# EAGLE design M8357pld (EAGLE 6.6.0)
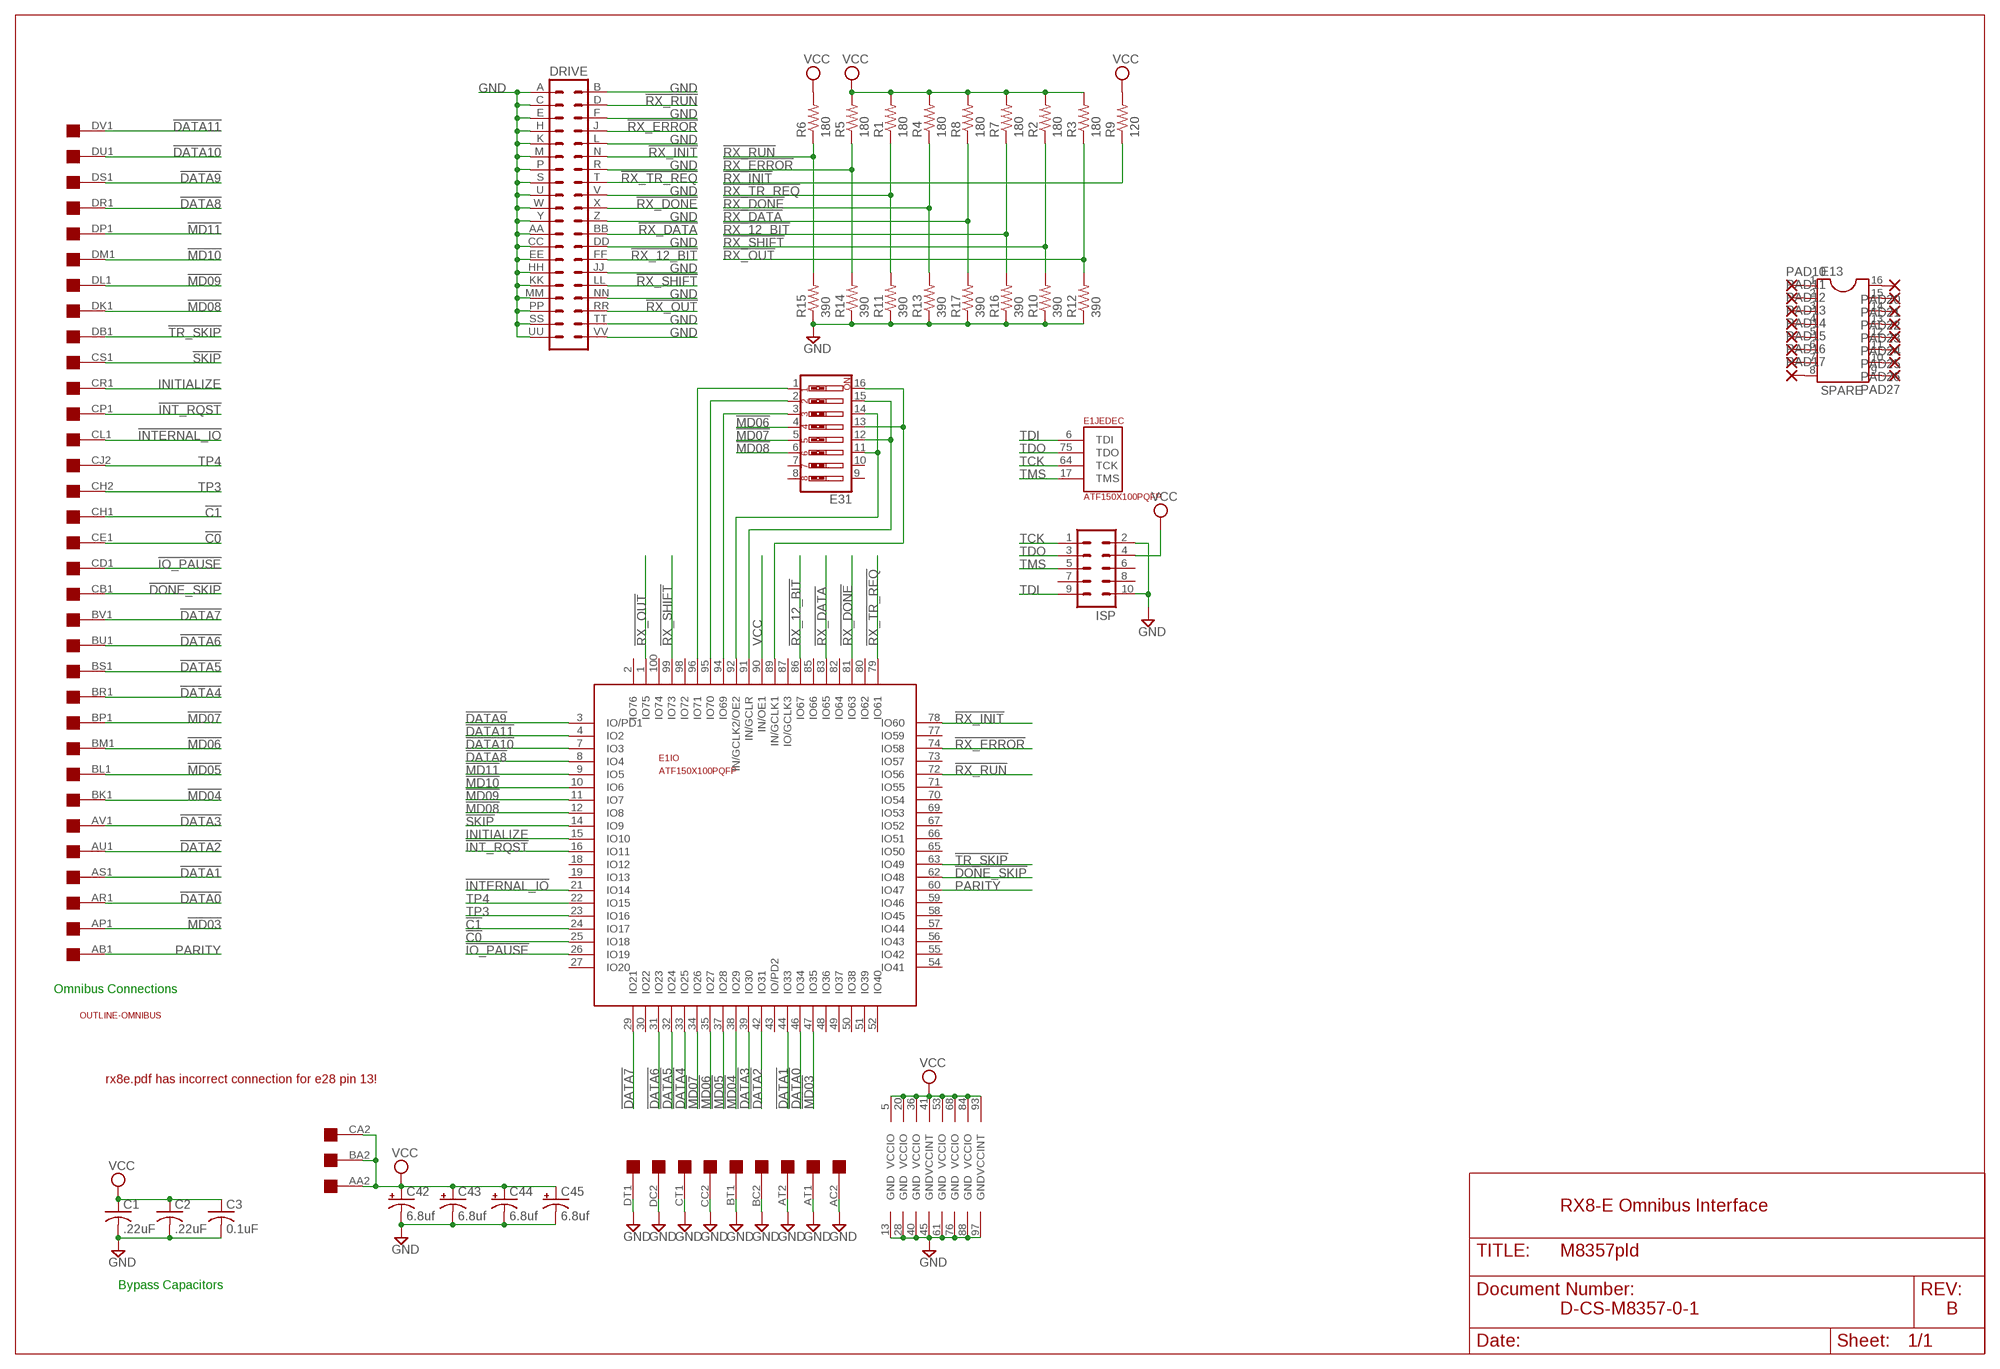
[diagram p0: schematic, sheet 1]

## Parts
C1  .22uF  C-US050-025X075  [C050-025X075]
C2  .22uF  C-US050-025X075  [C050-025X075]
C3  0.1uF  C-US050-025X075  [C050-025X075]
C42  6.8uf  CPOL-USE22-6AXIAL  [E22-6]
C43  6.8uf  CPOL-USE22-6AXIAL  [E22-6]
C44  6.8uf  CPOL-USE22-6AXIAL  [E22-6]
C45  6.8uf  CPOL-USE22-6AXIAL  [E22-6]
DRIVE  DEC40PINH  [DEC40PINH]
E1  ATF150X100PQFP  [PQFP-100]
E13  SPARE  DIL16  [DIL16]
E31  SW_DIP-8  [EDG-08]
ISP  ML10  [ML10]
PAD10  1,6/0,8  [1,6/0,8]
PAD11  1,6/0,8  [1,6/0,8]
PAD12  1,6/0,8  [1,6/0,8]
PAD13  1,6/0,8  [1,6/0,8]
PAD14  1,6/0,8  [1,6/0,8]
PAD15  1,6/0,8  [1,6/0,8]
PAD16  1,6/0,8  [1,6/0,8]
PAD17  1,6/0,8  [1,6/0,8]
PAD20  1,6/0,8  [1,6/0,8]
PAD21  1,6/0,8  [1,6/0,8]
PAD22  1,6/0,8  [1,6/0,8]
PAD23  1,6/0,8  [1,6/0,8]
PAD24  1,6/0,8  [1,6/0,8]
PAD25  1,6/0,8  [1,6/0,8]
PAD26  1,6/0,8  [1,6/0,8]
PAD27  1,6/0,8  [1,6/0,8]
R1  180  R-US_0207/10  [0207/10]
R2  180  R-US_0207/10  [0207/10]
R3  180  R-US_0207/10  [0207/10]
R4  180  R-US_0207/10  [0207/10]
R5  180  R-US_0207/10  [0207/10]
R6  180  R-US_0207/10  [0207/10]
R7  180  R-US_0207/10  [0207/10]
R8  180  R-US_0207/10  [0207/10]
R9  120  R-US_0207/10  [0207/10]
R10  390  R-US_0207/10  [0207/10]
R11  390  R-US_0207/10  [0207/10]
R12  390  R-US_0207/10  [0207/10]
R13  390  R-US_0207/10  [0207/10]
R14  390  R-US_0207/10  [0207/10]
R15  390  R-US_0207/10  [0207/10]
R16  390  R-US_0207/10  [0207/10]
R17  390  R-US_0207/10  [0207/10]
U$2  QUAD  [EDGE-CON8]
U$5  OUTLINE-OMNIBUS  [OMNIBUS]

## Nets
!C0: E1.25(IO:IO18) U$2.CE1
!C1: E1.24(IO:IO17) U$2.CH1
!DATA0: E1.46(IO:IO34) U$2.AR1
!DATA1: E1.44(IO:IO33) U$2.AS1
!DATA2: E1.42(IO:IO31) U$2.AU1
!DATA3: E1.39(IO:IO30) U$2.AV1
!DATA4: E1.33(IO:IO25) U$2.BR1
!DATA5: E1.32(IO:IO24) U$2.BS1
!DATA6: E1.31(IO:IO23) U$2.BU1
!DATA7: E1.29(IO:IO21) U$2.BV1
!DATA8: E1.8(IO:IO4) U$2.DR1
!DATA9: E1.3(IO:IO/PD1) U$2.DS1
!DATA10: E1.7(IO:IO3) U$2.DU1
!DATA11: E1.4(IO:IO2) U$2.DV1
!DONE_SKIP: E1.62(IO:IO48) U$2.CB1
!INT_RQST: E1.16(IO:IO11) U$2.CP1
!INTERNAL_IO: E1.21(IO:IO14) U$2.CL1
!IO_PAUSE: E1.26(IO:IO19) U$2.CD1
!MD03: E1.47(IO:IO35) U$2.AP1
!MD04: E1.38(IO:IO29) U$2.BK1
!MD05: E1.37(IO:IO28) U$2.BL1
!MD06: E1.35(IO:IO27) E31.4 U$2.BM1
!MD07: E1.34(IO:IO26) E31.5 U$2.BP1
!MD08: E1.12(IO:IO8) E31.6 U$2.DK1
!MD09: E1.11(IO:IO7) U$2.DL1
!MD10: E1.10(IO:IO6) U$2.DM1
!MD11: E1.9(IO:IO5) U$2.DP1
!RX_12_BIT: DRIVE.FF E1.86(IO:IO67) R7.1 R16.2
!RX_DATA: DRIVE.BB E1.83(IO:IO65) R8.1 R17.2
!RX_DONE: DRIVE.X E1.81(IO:IO63) R4.1 R13.2
!RX_ERROR: DRIVE.J E1.74(IO:IO58) R5.1 R14.2
!RX_INIT: DRIVE.N E1.78(IO:IO60) R9.1
!RX_OUT: DRIVE.RR E1.1(IO:IO75) R3.1 R12.2
!RX_RUN: DRIVE.D E1.72(IO:IO56) R6.1 R15.2
!RX_SHIFT: DRIVE.LL E1.99(IO:IO73) R2.1 R10.2
!RX_TR_REQ: DRIVE.T E1.79(IO:IO61) R1.1 R11.2
!SKIP: E1.14(IO:IO9) U$2.CS1
!TR_SKIP: E1.63(IO:IO49) U$2.DB1
GND [supply]: C1.2 C2.2 C3.2 C42.- C43.- C44.- C45.- DRIVE.A DRIVE.AA DRIVE.B DRIVE.C DRIVE.CC DRIVE.DD DRIVE.E DRIVE.EE DRIVE.F DRIVE.H DRIVE.HH DRIVE.JJ DRIVE.K DRIVE.KK DRIVE.L DRIVE.M DRIVE.MM DRIVE.NN DRIVE.P DRIVE.PP DRIVE.R DRIVE.S DRIVE.SS DRIVE.TT DRIVE.U DRIVE.UU DRIVE.V DRIVE.VV DRIVE.W DRIVE.Y DRIVE.Z E1.13(GND) E1.28(GND) E1.40(GND) E1.45(GND) E1.61(GND) E1.76(GND) E1.88(GND) E1.97(GND) ISP.2 ISP.10 R10.1 R11.1 R12.1 R13.1 R14.1 R15.1 R16.1 R17.1 U$2.AC2 U$2.AT1 U$2.AT2 U$2.BC2 U$2.BT1 U$2.CC2 U$2.CT1 U$2.DC2 U$2.DT1
INITIALIZE: E1.15(IO:IO10) U$2.CR1
N$1: E1.92(IO:IN/GCLK2/OE2) E31.11 E31.14
N$5: E1.91(IO:IN/GCLR) E31.12 E31.15
N$6: E1.89(IO:IN/GCLK1) E31.13 E31.16
N$7: E1.94(IO:IO69) E31.3
N$8: E1.95(IO:IO70) E31.2
N$9: E1.96(IO:IO71) E31.1
N$13: E13.1 PAD10.1(P)
N$14: E13.2 PAD11.1(P)
N$15: E13.3 PAD12.1(P)
N$16: E13.4 PAD13.1(P)
N$17: E13.5 PAD14.1(P)
N$18: E13.6 PAD15.1(P)
N$19: E13.7 PAD16.1(P)
N$20: E13.8 PAD17.1(P)
N$23: E13.16 PAD20.1(P)
N$24: E13.15 PAD21.1(P)
N$25: E13.14 PAD22.1(P)
N$26: E13.13 PAD23.1(P)
N$27: E13.12 PAD24.1(P)
N$28: E13.11 PAD25.1(P)
N$29: E13.10 PAD26.1(P)
N$30: E13.9 PAD27.1(P)
PARITY: E1.60(IO:IO47) U$2.AB1
TCK: E1.64(JEDEC:TCK) ISP.1
TDI: E1.6(JEDEC:TDI) ISP.9
TDO: E1.75(JEDEC:TDO) ISP.3
TMS: E1.17(JEDEC:TMS) ISP.5
TP3: E1.23(IO:IO16) U$2.CH2
TP4: E1.22(IO:IO15) U$2.CJ2
VCC [supply]: C1.1 C2.1 C3.1 C42.+ C43.+ C44.+ C45.+ E1.5(VCCIO) E1.20(VCCIO) E1.36(VCCIO) E1.41(VCCINT) E1.53(VCCIO) E1.68(VCCIO) E1.84(VCCIO) E1.90(IO:IN/OE1) E1.93(VCCINT) ISP.4 R1.2 R2.2 R3.2 R4.2 R5.2 R6.2 R7.2 R8.2 R9.2 U$2.AA2 U$2.BA2 U$2.CA2
Unconnected: E1.2(IO:IO76) E1.18(IO:IO12) E1.19(IO:IO13) E1.27(IO:IO20) E1.30(IO:IO22) E1.43(IO:IO/PD2) E1.48(IO:IO36) E1.49(IO:IO37) E1.50(IO:IO38) E1.51(IO:IO39) E1.52(IO:IO40) E1.54(IO:IO41) E1.55(IO:IO42) E1.56(IO:IO43) E1.57(IO:IO44) E1.58(IO:IO45) E1.59(IO:IO46) E1.65(IO:IO50) E1.66(IO:IO51) E1.67(IO:IO52) E1.69(IO:IO53) E1.70(IO:IO54) E1.71(IO:IO55) E1.73(IO:IO57) E1.77(IO:IO59) E1.80(IO:IO62) E1.82(IO:IO64) E1.85(IO:IO66) E1.87(IO:IO/GCLK3) E1.98(IO:IO72) E1.100(IO:IO74) E31.7 E31.8 E31.9 E31.10 ISP.6 ISP.7 ISP.8 U$2.AA1 U$2.AB2 U$2.AC1 U$2.AD1 U$2.AD2 U$2.AE1 U$2.AE2 U$2.AF1 U$2.AF2 U$2.AH1 U$2.AH2 U$2.AJ1 U$2.AJ2 U$2.AK1 U$2.AK2 U$2.AL1 U$2.AL2 U$2.AM1 U$2.AM2 U$2.AN1 U$2.AN2 U$2.AP2 U$2.AR2 U$2.AS2 U$2.AU2 U$2.AV2 U$2.BA1 U$2.BB1 U$2.BB2 U$2.BC1 U$2.BD1 U$2.BD2 U$2.BE1 U$2.BE2 U$2.BF1 U$2.BF2 U$2.BH1 U$2.BH2 U$2.BJ1 U$2.BJ2 U$2.BK2 U$2.BL2 U$2.BM2 U$2.BN1 U$2.BN2 U$2.BP2 U$2.BR2 U$2.BS2 U$2.BT2 U$2.BU2 U$2.BV2 U$2.CA1 U$2.CB2 U$2.CC1 U$2.CD2 U$2.CE2 U$2.CF1 U$2.CF2 U$2.CJ1 U$2.CK1 U$2.CK2 U$2.CL2 U$2.CM1 U$2.CM2 U$2.CN1 U$2.CN2 U$2.CP2 U$2.CR2 U$2.CS2 U$2.CT2 U$2.CU1 U$2.CU2 U$2.CV1 U$2.CV2 U$2.DA1 U$2.DA2 U$2.DB2 U$2.DC1 U$2.DD1 U$2.DD2 U$2.DE1 U$2.DE2 U$2.DF1 U$2.DF2 U$2.DH1 U$2.DH2 U$2.DJ1 U$2.DJ2 U$2.DK2 U$2.DL2 U$2.DM2 U$2.DN1 U$2.DN2 U$2.DP2 U$2.DR2 U$2.DS2 U$2.DT2 U$2.DU2 U$2.DV2

## Notes on the sheet
- Omnibus Connections
- rx8e.pdf has incorrect connection for e28 pin 13!
- RX8-E Omnibus Interface
- Bypass Capacitors
- D-CS-M8357-0-1 | B

## Library data of the parts
C1-C3 = rcl:C-US: CAPACITOR, American symbol
C42-C45 = rcl:CPOL-US: POLARIZED CAPACITOR, American symbol
DRIVE = dec-con:DEC40PIN: PIN HEADER
E1 = atmel-cpld:ATF150X100: ATF150x in 100 pin package.
E13 = ic-package:DIL16: Dual In Line / Socket
E31 = special:SW_DIP-8: DIP SWITCH
ISP = con-ml:ML10: HARTING; OC_FARNELL: unknown; OC_NEWARK: unknown
PAD10-PAD17 PAD20-PAD27 = wirepad:1,6/0,8: THROUGH-HOLE PAD
R1-R17 = rcl:R-US_: RESISTOR, American symbol
U$2 = dec-con:QUAD: Quad-Height DEC board
U$5 = dec-con:OUTLINE-*: Board outlines for DEC boards.

## Board
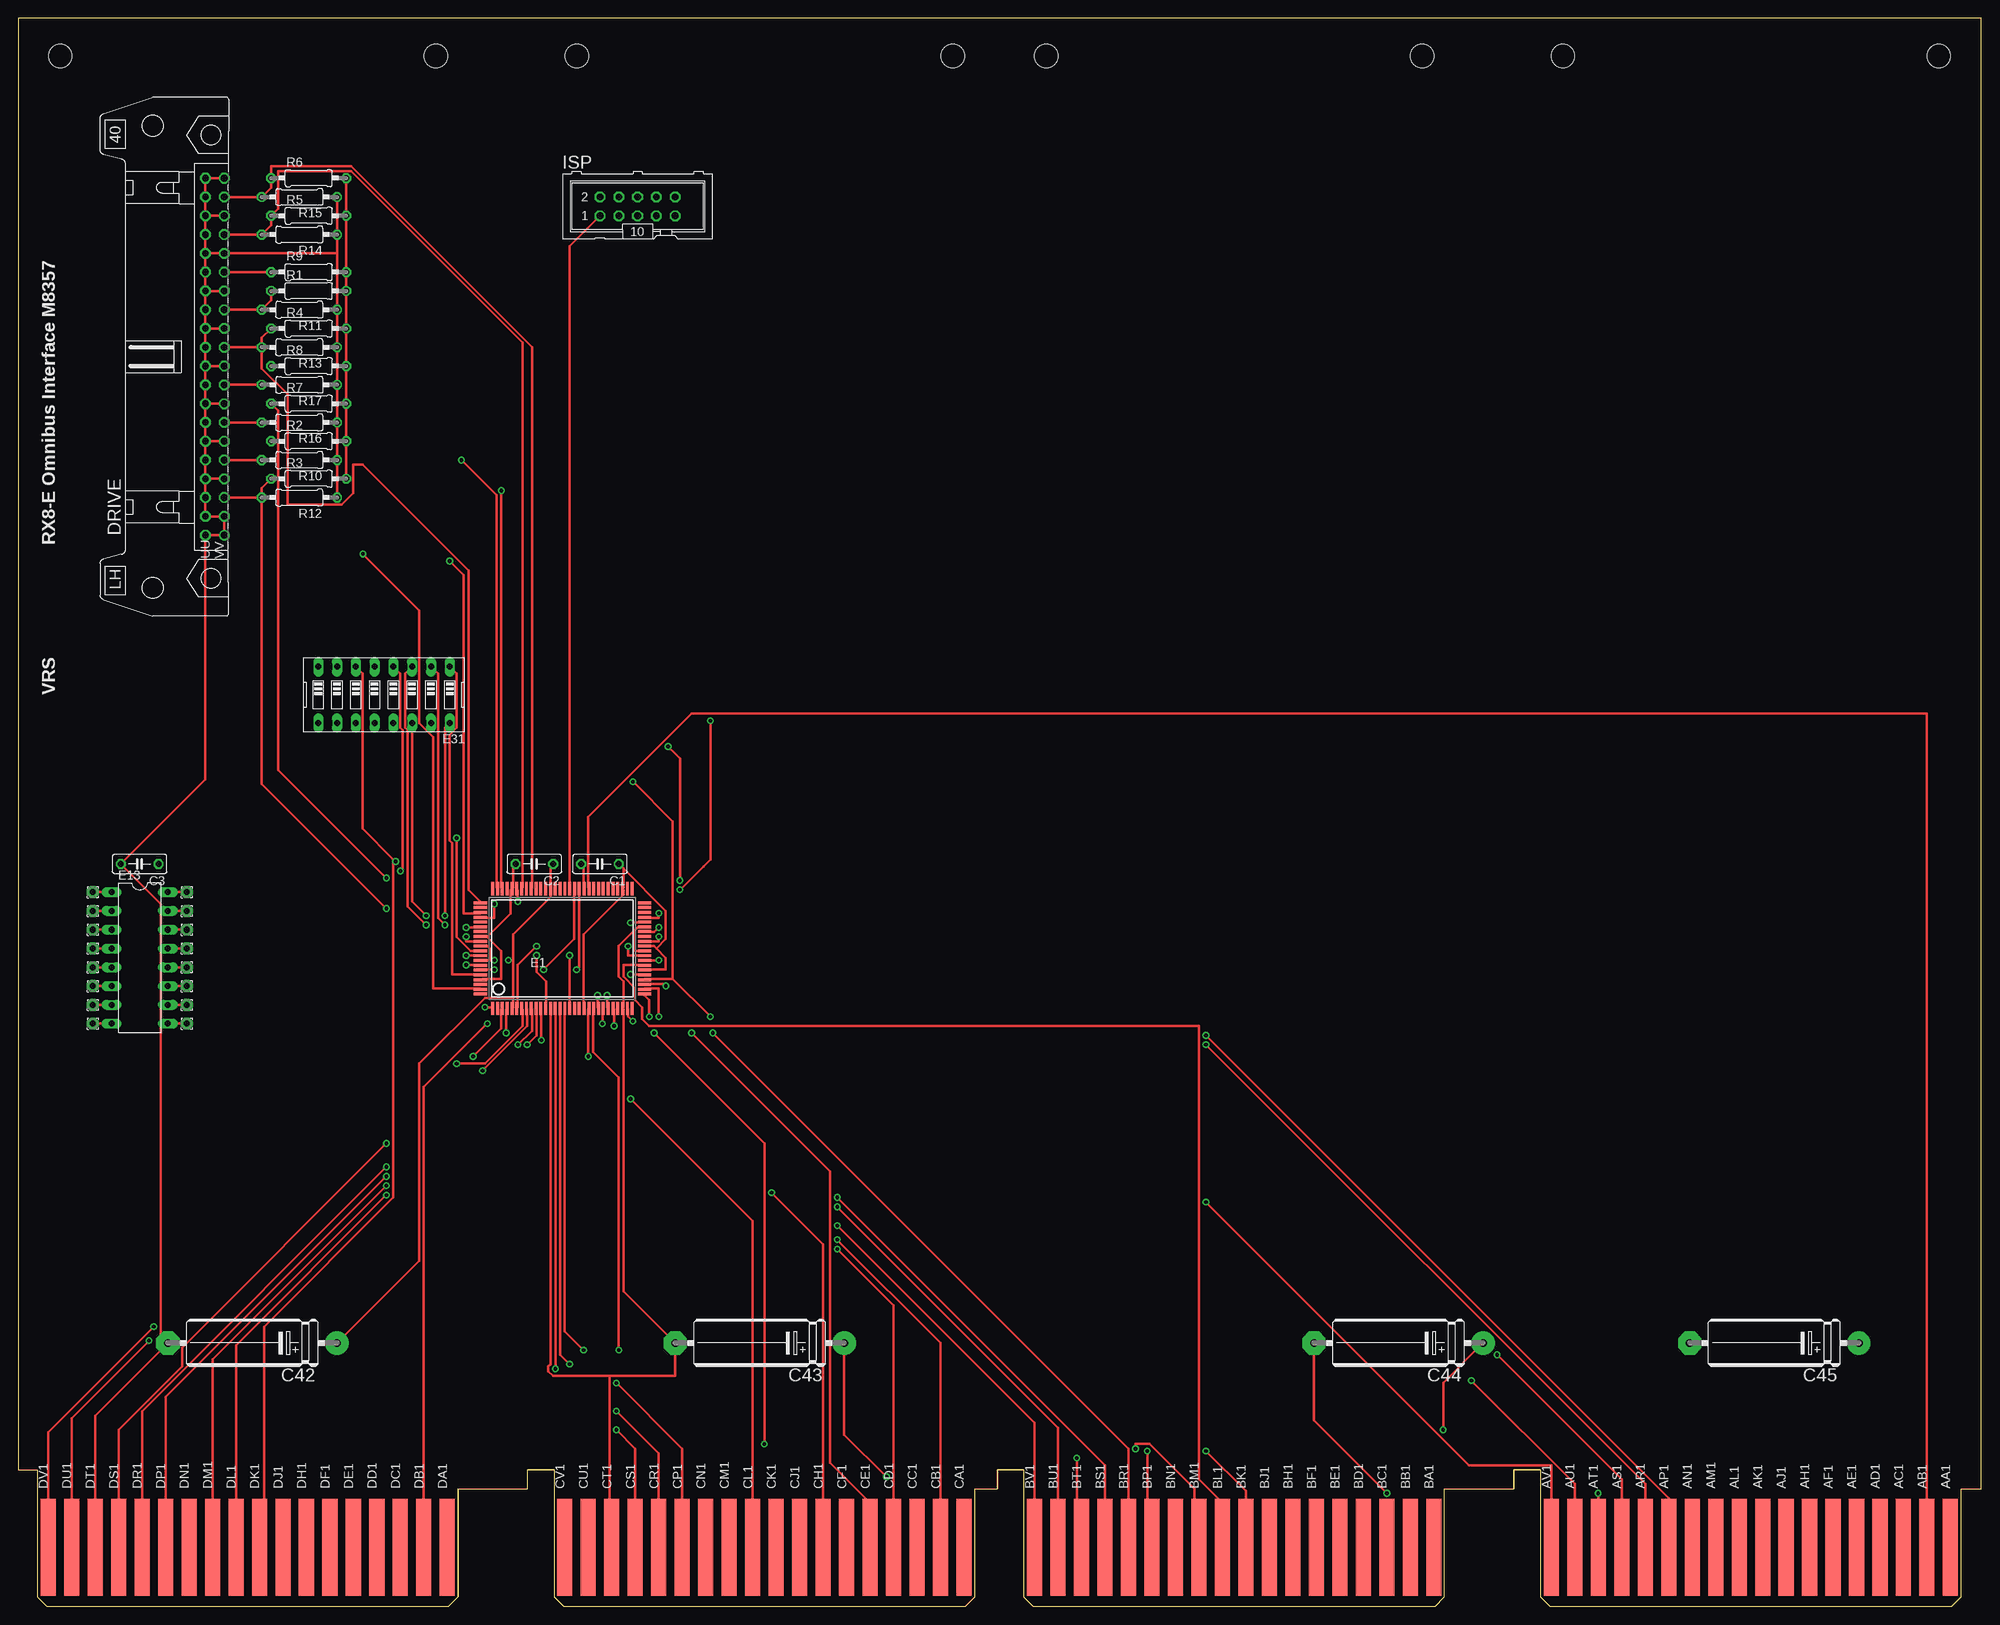
[diagram p1: board, top side]
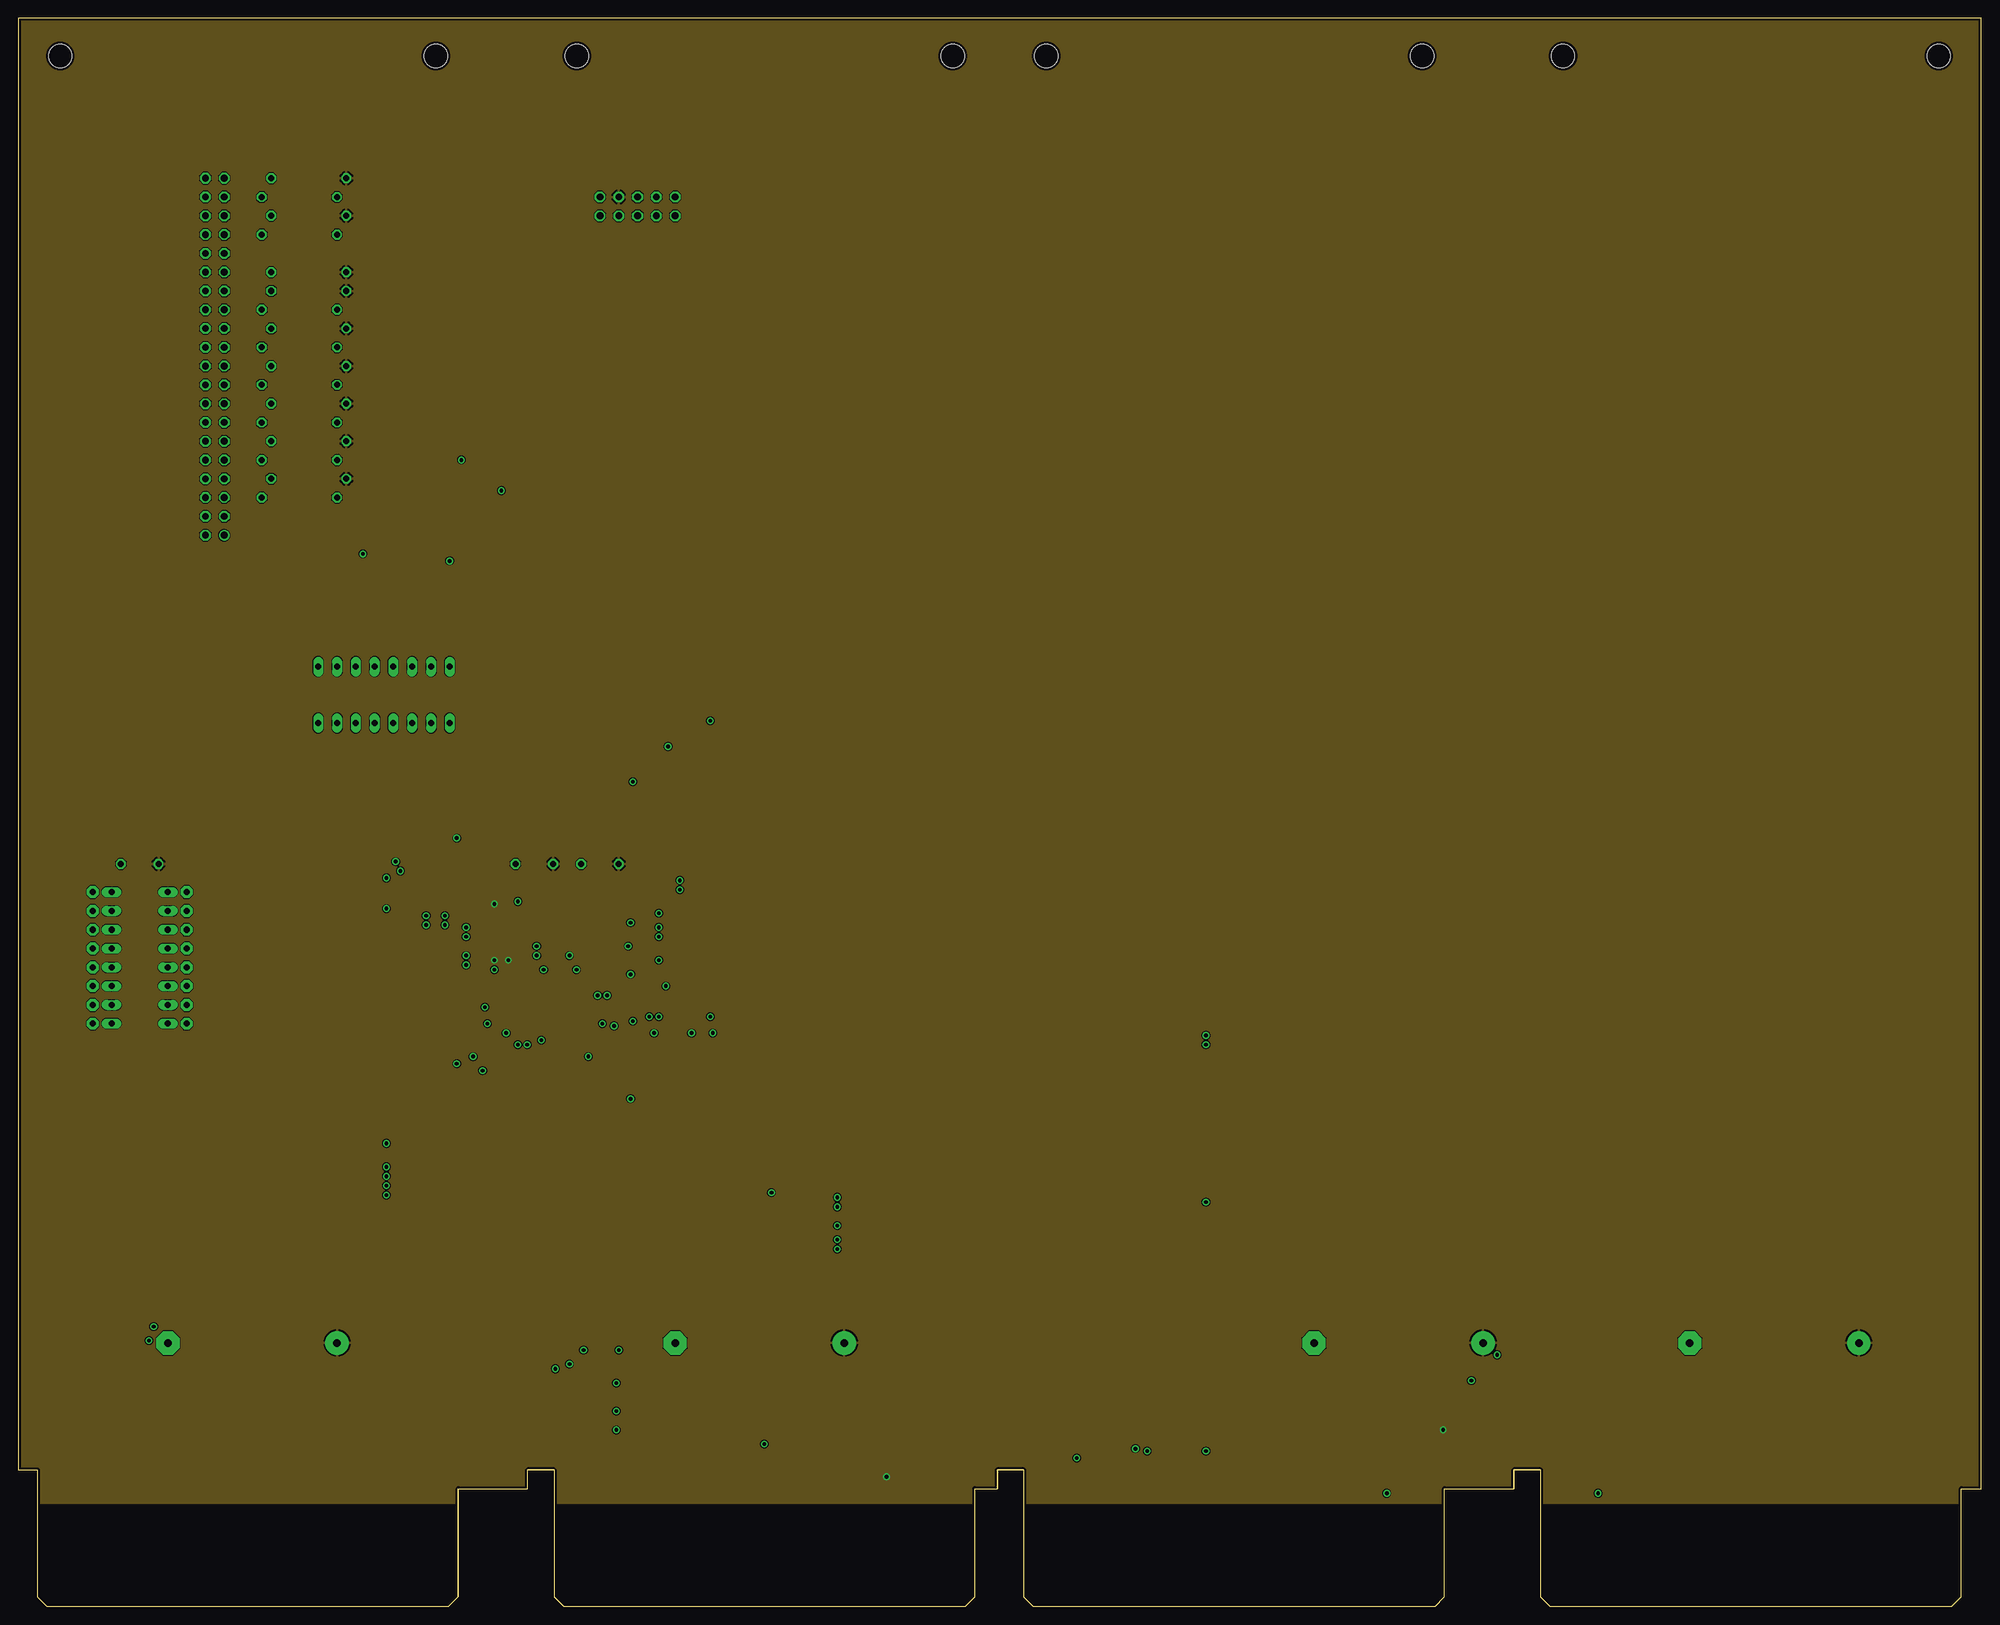
[diagram p2: board, inner layer VCC$]
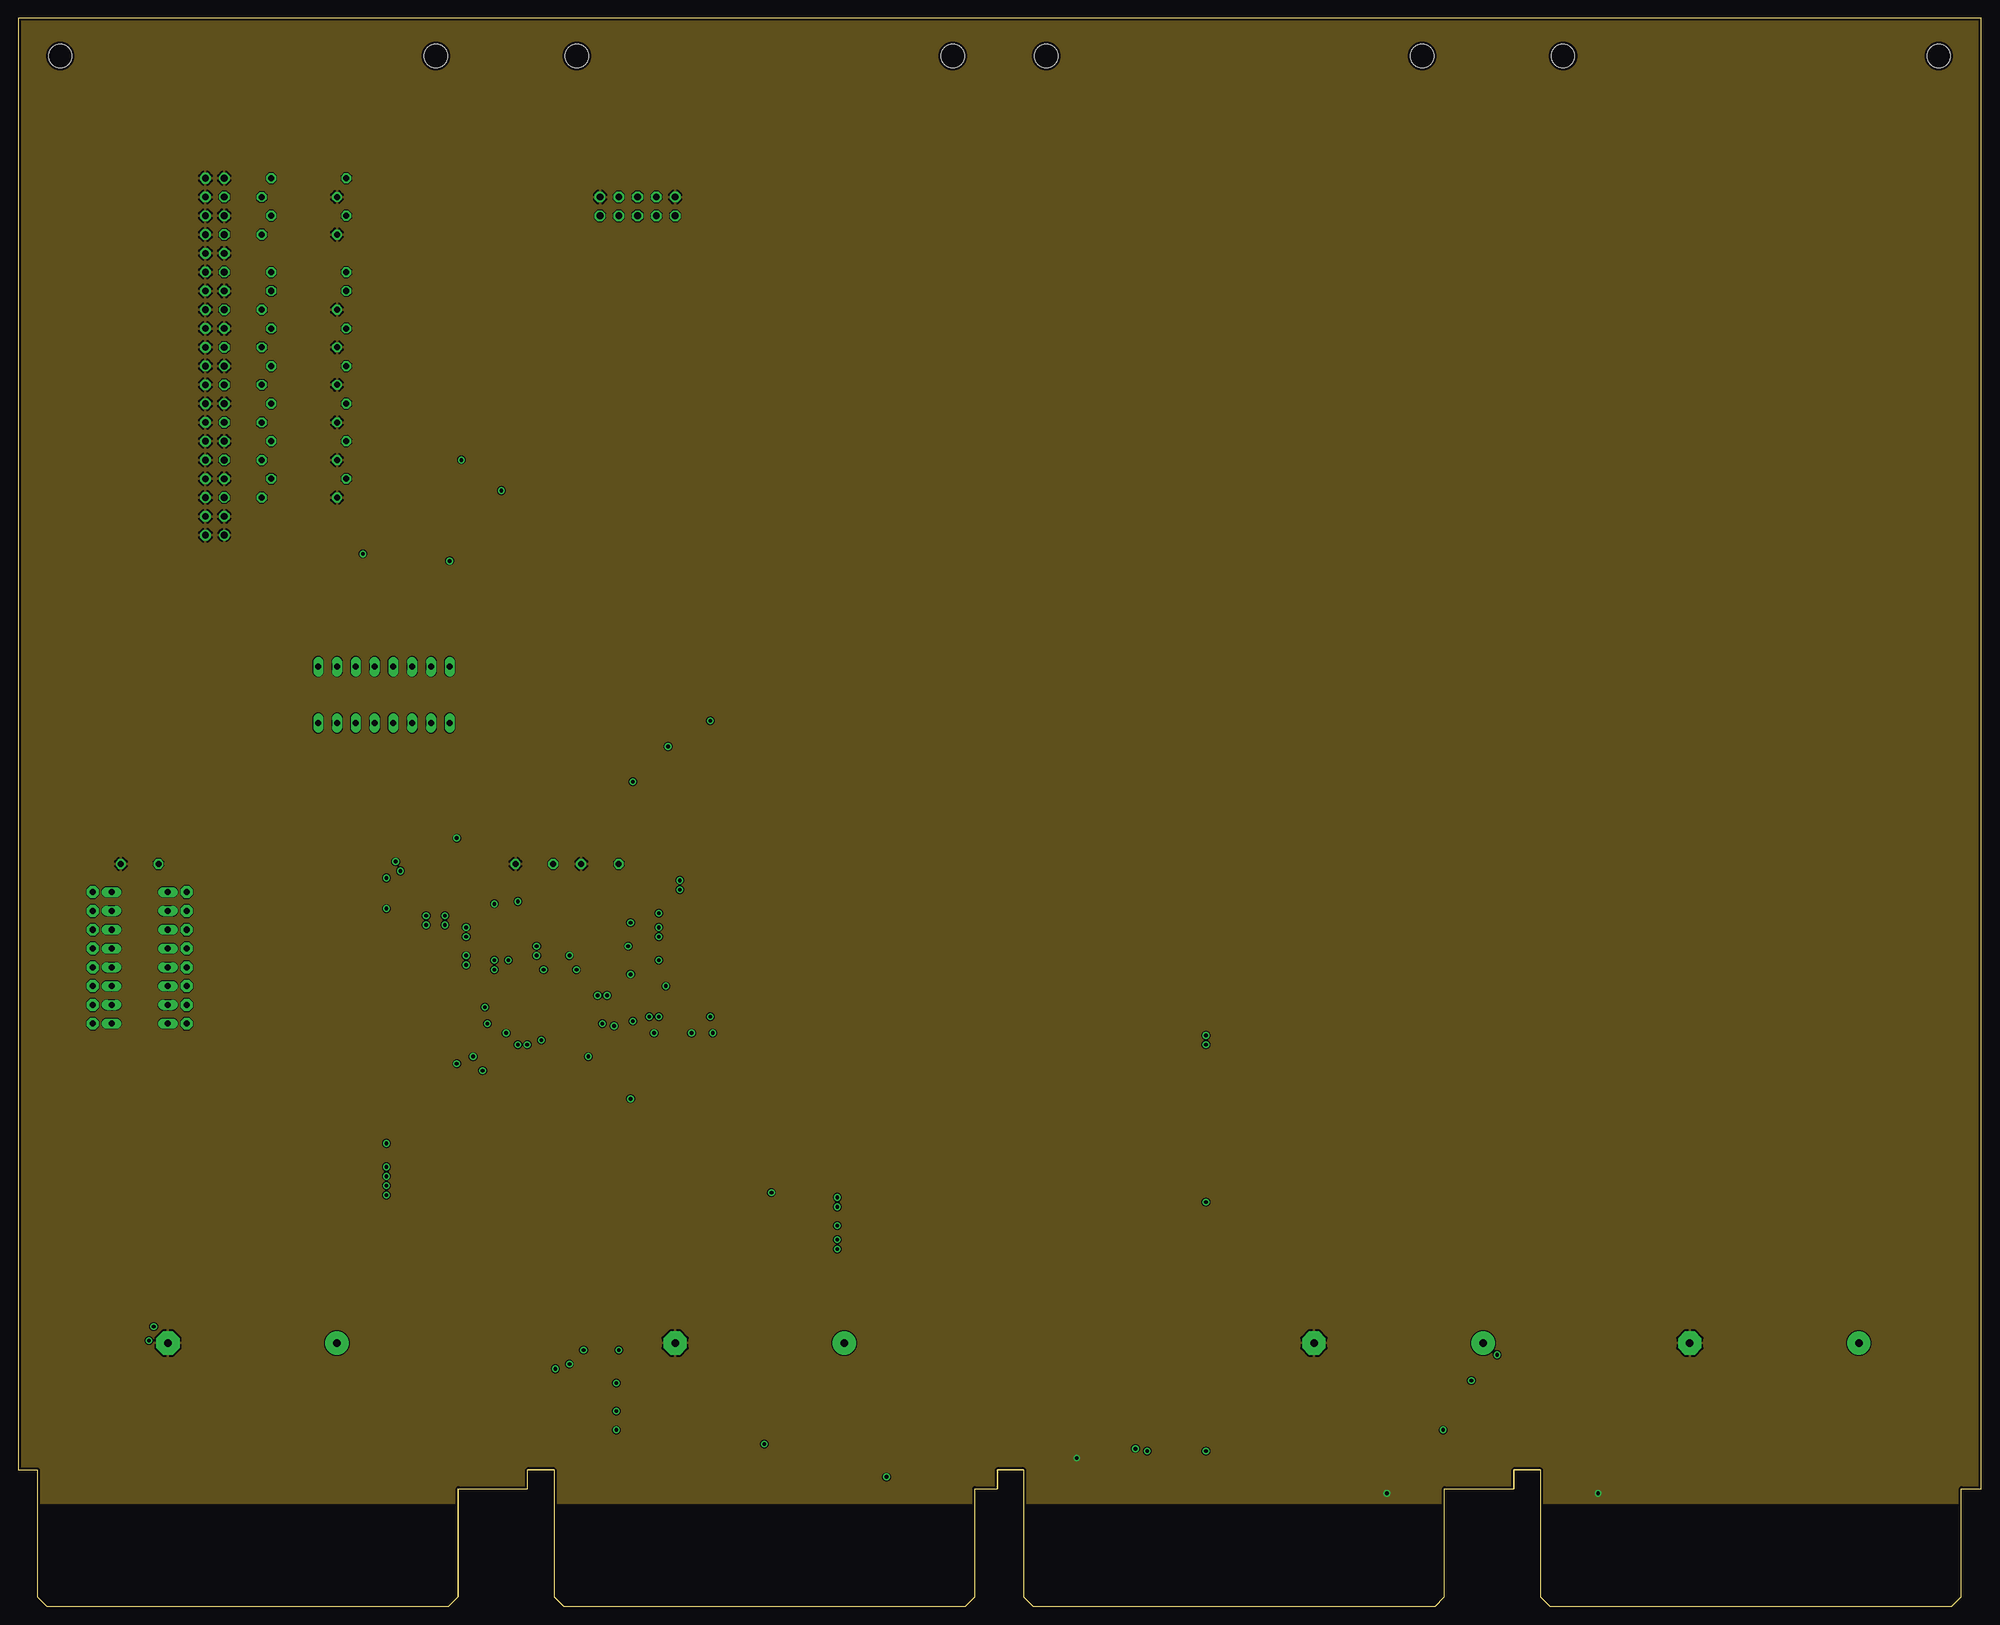
[diagram p3: board, inner layer GND$]
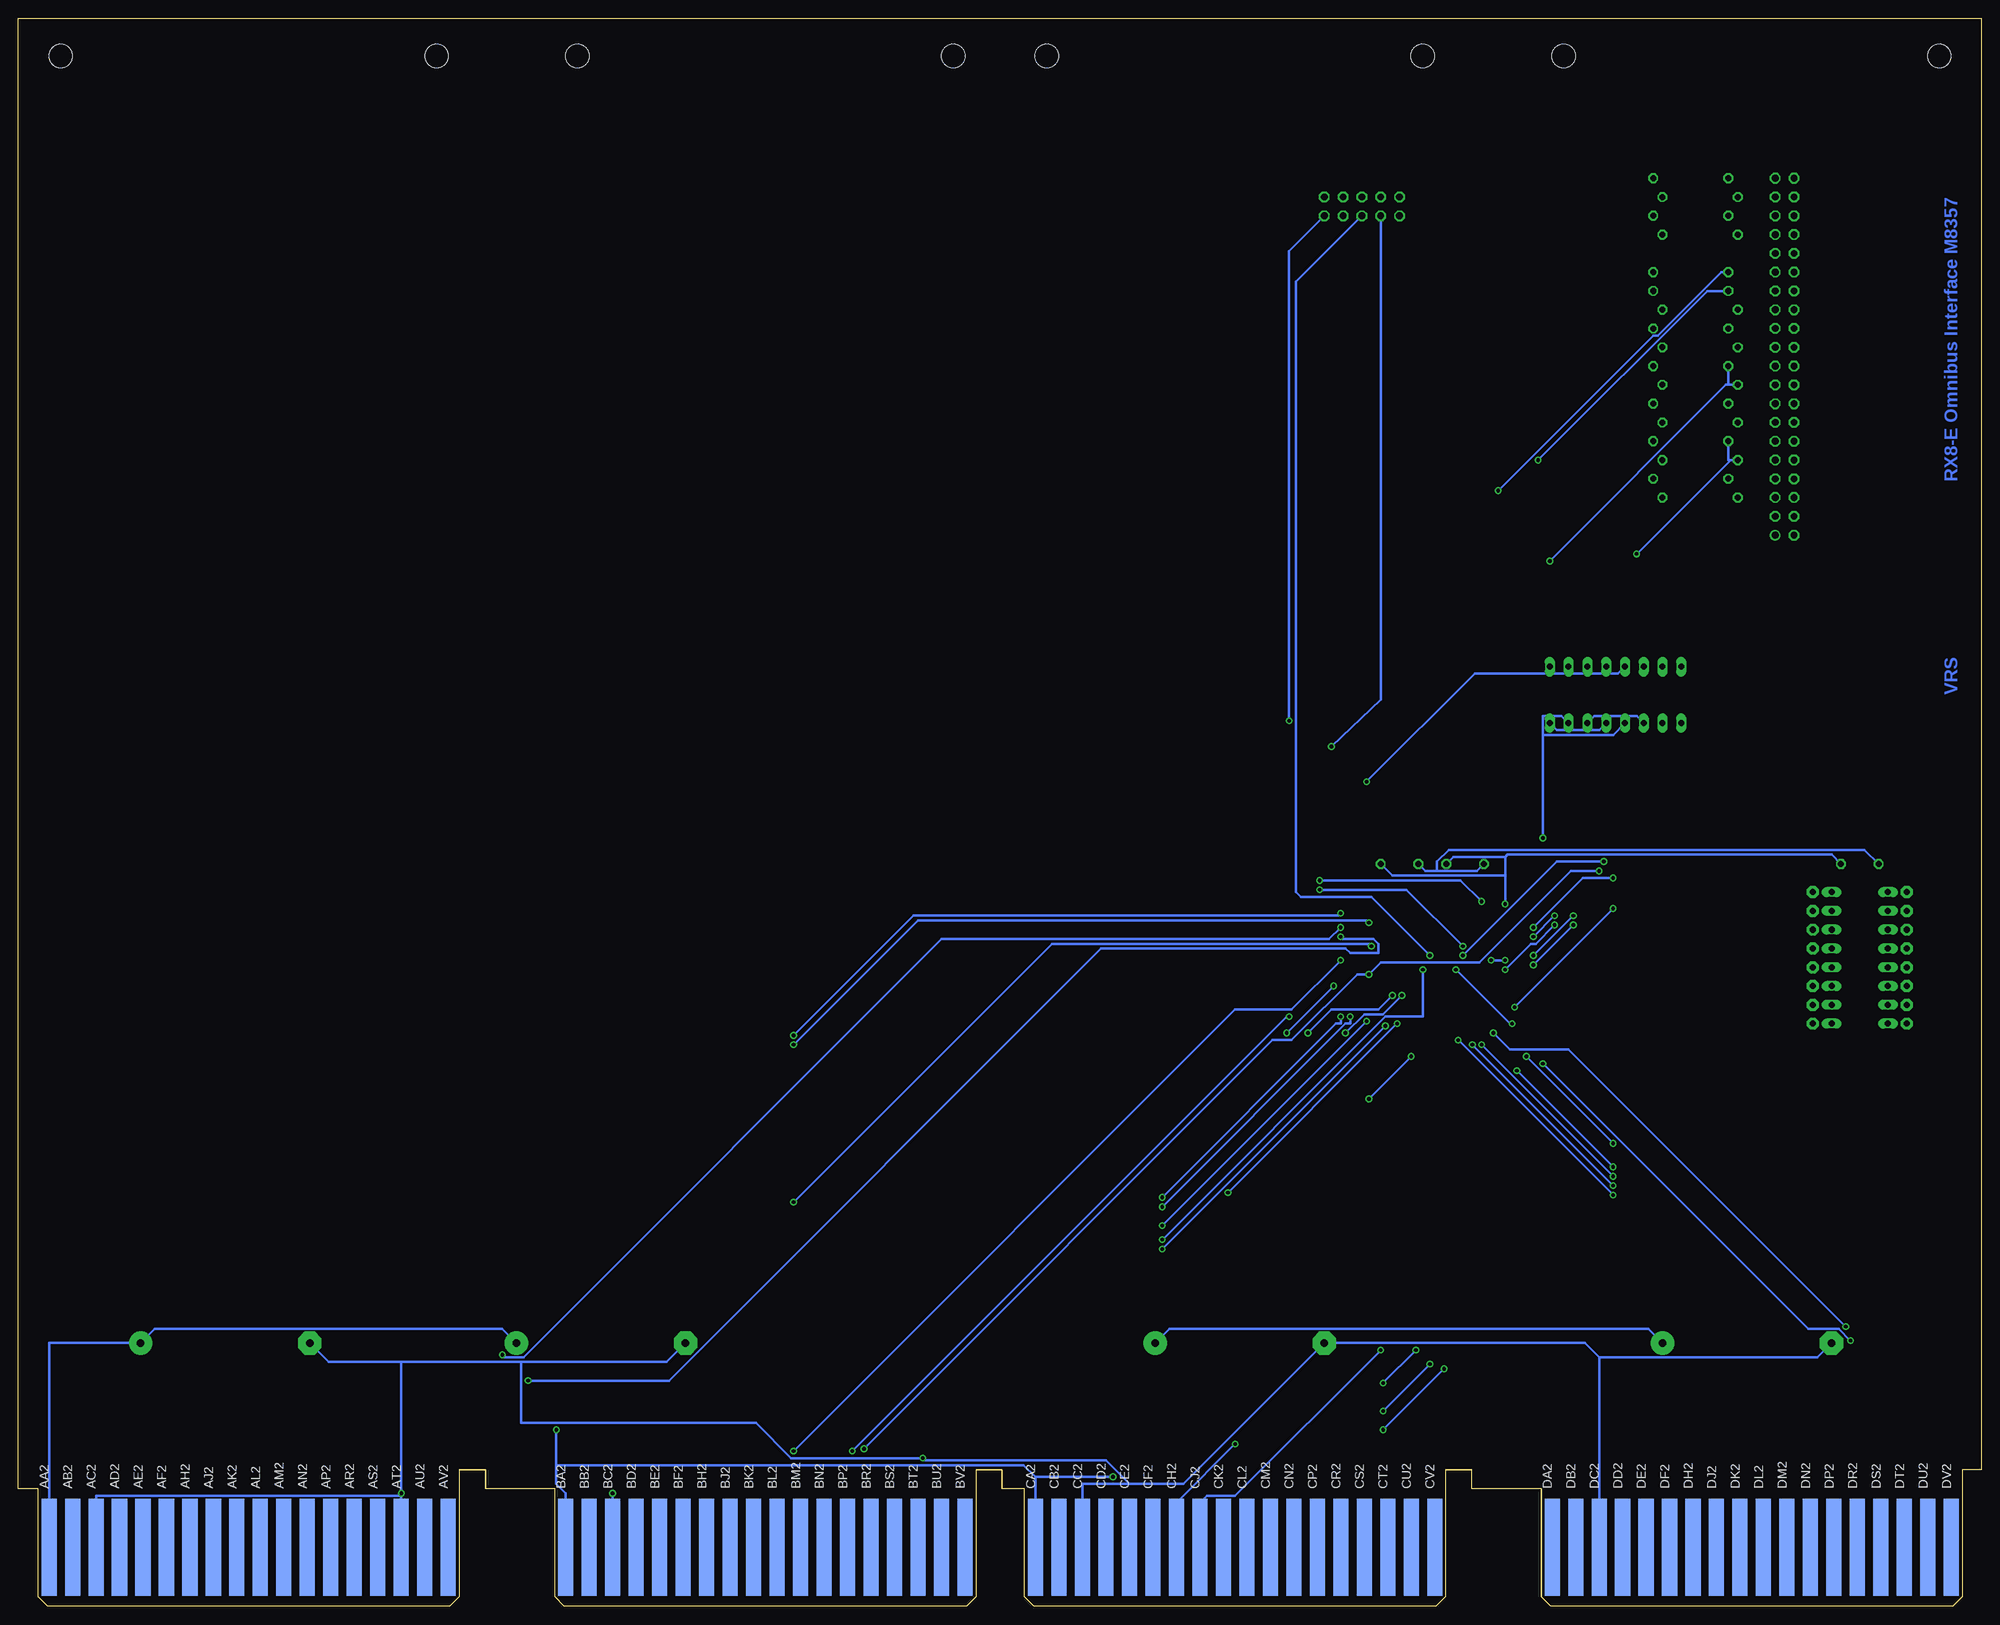
[diagram p4: board, bottom side, seen from below]

Size 265.3 x 214.63 mm. Coordinates in mm from the lower left corner, seen from the top.
Copper layers (1+2+3+16): Top 0.035mm / dielectric 1.5mm / VCC$ 0.035mm / dielectric 0.15mm / GND$ 0.035mm / dielectric 0.2mm / Bottom 0.035mm
Design rules "pld *": minimum track width 12mil, minimum drill 20mil, track to track 5mil, track to pad 5mil, pad to pad 5mil, via to via 10mil, smd to smd 5mil, copper to edge 13mil, drill to drill 10mil, minimum pad ring 10mil, minimum via ring 8mil, stop-mask expansion 0mil, vias tented up to drill 0mil, thermal gap 10mil

### Footprints (pad centres in the part's own frame; a part is rotated, then mirrored left to right if it is on the bottom)
C050-025X075 = drill 0.813 octagon: 1 -2.54,0; 2 2.54,0
E22-6 = drill 1.016 pad 3.15: + -11.43,0 | drill 1.016 pad 3.15 octagon: - 11.43,0
DEC40PINH = drill 0.914 octagon: A 24.13,1.27; AA -3.81,1.27; B 24.13,-1.27; BB -3.81,-1.27; C 21.59,1.27; CC -6.35,1.27; D 21.59,-1.27; DD -6.35,-1.27; E 19.05,1.27; EE -8.89,1.27; F 19.05,-1.27; FF -8.89,-1.27; H 16.51,1.27; HH -11.43,1.27; J 16.51,-1.27; JJ -11.43,-1.27; K 13.97,1.27; KK -13.97,1.27; L 13.97,-1.27; LL -13.97,-1.27; M 11.43,1.27; MM -16.51,1.27; N 11.43,-1.27; NN -16.51,-1.27; P 8.89,1.27; PP -19.05,1.27; R 8.89,-1.27; RR -19.05,-1.27; S 6.35,1.27; SS -21.59,1.27; T 6.35,-1.27; TT -21.59,-1.27; U 3.81,1.27; UU -24.13,1.27; V 3.81,-1.27; W 1.27,1.27; X 1.27,-1.27; Y -1.27,1.27; Z -1.27,-1.27 | drill 0.914: VV -24.13,-1.27
PQFP-100 = smd 0.4 x 1.8: 1 -9.425,-8.1; 2 -8.775,-8.1; 3 -8.125,-8.1; 4 -7.475,-8.1; 5 -6.825,-8.1; 6 -6.175,-8.1; 7 -5.525,-8.1; 8 -4.875,-8.1; 9 -4.225,-8.1; 10 -3.575,-8.1; 11 -2.925,-8.1; 12 -2.275,-8.1; 13 -1.625,-8.1; 14 -0.975,-8.1; 15 -0.325,-8.1; 16 0.325,-8.1; 17 0.975,-8.1; 18 1.625,-8.1; 19 2.275,-8.1; 20 2.925,-8.1; 21 3.575,-8.1; 22 4.225,-8.1; 23 4.875,-8.1; 24 5.525,-8.1; 25 6.175,-8.1; 26 6.825,-8.1; 27 7.475,-8.1; 28 8.125,-8.1; 29 8.775,-8.1; 30 9.425,-8.1; 51 9.425,8.1; 52 8.775,8.1; 53 8.125,8.1; 54 7.475,8.1; 55 6.825,8.1; 56 6.175,8.1; 57 5.525,8.1; 58 4.875,8.1; 59 4.225,8.1; 60 3.575,8.1; 61 2.925,8.1; 62 2.275,8.1; 63 1.625,8.1; 64 0.975,8.1; 65 0.325,8.1; 66 -0.325,8.1; 67 -0.975,8.1; 68 -1.625,8.1; 69 -2.275,8.1; 70 -2.925,8.1; 71 -3.575,8.1; 72 -4.225,8.1; 73 -4.875,8.1; 74 -5.525,8.1; 75 -6.175,8.1; 76 -6.825,8.1; 77 -7.475,8.1; 78 -8.125,8.1; 79 -8.775,8.1; 80 -9.425,8.1 | smd 1.8 x 0.4: 31 11.1,-6.175; 32 11.1,-5.525; 33 11.1,-4.875; 34 11.1,-4.225; 35 11.1,-3.575; 36 11.1,-2.925; 37 11.1,-2.275; 38 11.1,-1.625; 39 11.1,-0.975; 40 11.1,-0.325; 41 11.1,0.325; 42 11.1,0.975; 43 11.1,1.625; 44 11.1,2.275; 45 11.1,2.925; 46 11.1,3.575; 47 11.1,4.225; 48 11.1,4.875; 49 11.1,5.525; 50 11.1,6.175; 81 -11.1,6.175; 82 -11.1,5.525; 83 -11.1,4.875; 84 -11.1,4.225; 85 -11.1,3.575; 86 -11.1,2.925; 87 -11.1,2.275; 88 -11.1,1.625; 89 -11.1,0.975; 90 -11.1,0.325; 91 -11.1,-0.325; 92 -11.1,-0.975; 93 -11.1,-1.625; 94 -11.1,-2.275; 95 -11.1,-2.925; 96 -11.1,-3.575; 97 -11.1,-4.225; 98 -11.1,-4.875; 99 -11.1,-5.525; 100 -11.1,-6.175
DIL16 = drill 0.813 long: 1 -8.89,-3.81; 2 -6.35,-3.81; 3 -3.81,-3.81; 4 -1.27,-3.81; 5 1.27,-3.81; 6 3.81,-3.81; 7 6.35,-3.81; 8 8.89,-3.81; 9 8.89,3.81; 10 6.35,3.81; 11 3.81,3.81; 12 1.27,3.81; 13 -1.27,3.81; 14 -3.81,3.81; 15 -6.35,3.81; 16 -8.89,3.81
EDG-08 = drill 0.813 long: 1 -8.89,-3.81; 2 -6.35,-3.81; 3 -3.81,-3.81; 4 -1.27,-3.81; 5 1.27,-3.81; 6 3.81,-3.81; 7 6.35,-3.81; 8 8.89,-3.81; 9 8.89,3.81; 10 6.35,3.81; 11 3.81,3.81; 12 1.27,3.81; 13 -1.27,3.81; 14 -3.81,3.81; 15 -6.35,3.81; 16 -8.89,3.81
ML10 = drill 0.914 octagon: 1 -5.08,-1.27; 2 -5.08,1.27; 3 -2.54,-1.27; 4 -2.54,1.27; 5 0,-1.27; 6 0,1.27; 7 2.54,-1.27; 8 2.54,1.27; 9 5.08,-1.27; 10 5.08,1.27
1,6/0,8 = drill 0.813 pad 1.6 octagon: 1 0,0
0207/10 = drill 0.813 octagon: 1 -5.08,0; 2 5.08,0
EDGE-CON8 = smd 2.032 x 13.106: AA1 261.303,7.938; AB1 258.127,7.938; AC1 254.952,7.938; AD1 251.778,7.938; AE1 248.602,7.938; AF1 245.428,7.938; AH1 242.252,7.938; AJ1 239.077,7.938; AK1 235.903,7.938; AL1 232.727,7.938; AM1 229.553,7.938; AN1 226.377,7.938; AP1 223.202,7.938; AR1 220.028,7.938; AS1 216.852,7.938; AT1 213.678,7.938; AU1 210.502,7.938; AV1 207.327,7.938; BA1 191.452,7.938; BB1 188.278,7.938; BC1 185.102,7.938; BD1 181.928,7.938; BE1 178.752,7.938; BF1 175.577,7.938; BH1 172.403,7.938; BJ1 169.227,7.938; BK1 166.053,7.938; BL1 162.877,7.938; BM1 159.702,7.938; BN1 156.528,7.938; BP1 153.352,7.938; BR1 150.178,7.938; BS1 147.002,7.938; BT1 143.827,7.938; BU1 140.653,7.938; BV1 137.477,7.938; CA1 127.953,7.938; CB1 124.778,7.938; CC1 121.603,7.938; CD1 118.427,7.938; CE1 115.252,7.938; CF1 112.078,7.938; CH1 108.903,7.938; CJ1 105.728,7.938; CK1 102.552,7.938; CL1 99.377,7.938; CM1 96.203,7.938; CN1 93.028,7.938; CP1 89.853,7.938; CR1 86.677,7.938; CS1 83.502,7.938; CT1 80.328,7.938; CU1 77.153,7.938; CV1 73.978,7.938; DA1 58.102,7.938; DB1 54.928,7.938; DC1 51.752,7.938; DD1 48.578,7.938; DE1 45.403,7.938; DF1 42.227,7.938; DH1 39.053,7.938; DJ1 35.877,7.938; DK1 32.703,7.938; DL1 29.527,7.938; DM1 26.352,7.938; DN1 23.177,7.938; DP1 20.003,7.938; DR1 16.828,7.938; DS1 13.652,7.938; DT1 10.477,7.938; DU1 7.303,7.938; DV1 4.128,7.938 | smd 2.032 x 13.106 bottom: AA2 261.303,7.938; AB2 258.127,7.938; AC2 254.952,7.938; AD2 251.778,7.938; AE2 248.602,7.938; AF2 245.428,7.938; AH2 242.252,7.938; AJ2 239.077,7.938; AK2 235.903,7.938; AL2 232.727,7.938; AM2 229.553,7.938; AN2 226.377,7.938; AP2 223.202,7.938; AR2 220.028,7.938; AS2 216.852,7.938; AT2 213.678,7.938; AU2 210.502,7.938; AV2 207.327,7.938; BA2 191.452,7.938; BB2 188.278,7.938; BC2 185.102,7.938; BD2 181.928,7.938; BE2 178.752,7.938; BF2 175.577,7.938; BH2 172.403,7.938; BJ2 169.227,7.938; BK2 166.053,7.938; BL2 162.877,7.938; BM2 159.702,7.938; BN2 156.528,7.938; BP2 153.352,7.938; BR2 150.178,7.938; BS2 147.002,7.938; BT2 143.827,7.938; BU2 140.653,7.938; BV2 137.477,7.938; CA2 127.953,7.938; CB2 124.778,7.938; CC2 121.603,7.938; CD2 118.427,7.938; CE2 115.252,7.938; CF2 112.078,7.938; CH2 108.903,7.938; CJ2 105.728,7.938; CK2 102.552,7.938; CL2 99.377,7.938; CM2 96.203,7.938; CN2 93.028,7.938; CP2 89.853,7.938; CR2 86.677,7.938; CS2 83.502,7.938; CT2 80.328,7.938; CU2 77.153,7.938; CV2 73.978,7.938; DA2 58.102,7.938; DB2 54.928,7.938; DC2 51.752,7.938; DD2 48.578,7.938; DE2 45.403,7.938; DF2 42.227,7.938; DH2 39.053,7.938; DJ2 35.877,7.938; DK2 32.703,7.938; DL2 29.527,7.938; DM2 26.352,7.938; DN2 23.177,7.938; DP2 20.003,7.938; DR2 16.828,7.938; DS2 13.652,7.938; DT2 10.477,7.938; DU2 7.303,7.938; DV2 4.128,7.938
OMNIBUS = hole 3.175: 208.915,209.55; 259.715,209.55; 189.865,209.55; 139.065,209.55; 75.616,209.55; 126.416,209.55; 56.566,209.55; 5.766,209.55

### Placement (x,y rotation side)
C1  78.61,100.33 180 top
C2  69.72,100.33 180 top
C3  16.38,100.33 180 top
C42  31.62,35.56 180 top
C43  100.2,35.56 180 top
C44  186.56,35.56 180 top
C45  237.36,35.56 180 top
DRIVE  26.54,168.91 90 top
E1  73.53,88.9 0 top
E13  16.38,87.63 270 top
E31  49.4,123.19 180 top
ISP  83.69,189.23 0 top
PAD10  10.03,96.52 90 top
PAD11  10.03,93.98 90 top
PAD12  10.03,91.44 90 top
PAD13  10.03,88.9 90 top
PAD14  10.03,86.36 90 top
PAD15  10.03,83.82 90 top
PAD16  10.03,81.28 90 top
PAD17  10.03,78.74 90 top
PAD20  22.73,96.52 90 top
PAD21  22.73,93.98 90 top
PAD22  22.73,91.44 90 top
PAD23  22.73,88.9 90 top
PAD24  22.73,86.36 90 top
PAD25  22.73,83.82 90 top
PAD26  22.73,81.28 90 top
PAD27  22.73,78.74 90 top
R1  39.24,177.8 0 top
R2  39.24,157.48 0 top
R3  39.24,152.4 0 top
R4  39.24,172.72 0 top
R5  39.24,187.96 0 top
R6  39.24,193.04 0 top
R7  39.24,162.56 0 top
R8  39.24,167.64 0 top
R9  39.24,180.34 0 top
R10  37.97,154.94 180 top
R11  37.97,175.26 180 top
R12  37.97,149.86 180 top
R13  37.97,170.18 180 top
R14  37.97,185.42 180 top
R15  37.97,190.5 180 top
R16  37.97,160.02 180 top
R17  37.97,165.1 180 top
U$2  -0.13,0 0 top
U$5  -0.13,0 0 top

### Tracks (layer width: path | path; a pad name or v marks a point on that pad's centre or on a via)
!C0  (via drill 0.51)
  Top 0.305: v79.56,82.55 79.56,80.96 E1.25 | v91,77.47 109.73,58.74 109.73,19.37 115.12,13.97 U$2.CE1
  Bottom 0.305: v79.56,82.55 81.47,80.64 87.82,80.64 v91,77.47
!C1  (via drill 0.51)
  Top 0.305: v78.93,78.74 78.93,80.64 E1.24 | v101.79,55.88 108.78,48.9 U$2.CH1
  Bottom 0.305: v101.79,55.88 v78.93,78.74
!DATA0  (via drill 0.51)
  Top 0.305: v82.74,92.39 84.33,92.39 E1.46 | v160.53,75.88 219.9,16.51 U$2.AR1
  Bottom 0.305: v82.74,92.39 83.06,92.71 143.7,92.71 v160.53,75.88
!DATA1  (via drill 0.51)
  Top 0.305: v86.55,91.76 85.92,91.12 84.65,91.12 E1.44 | v199.9,33.97 216.72,17.14 U$2.AS1
  Bottom 0.305: v86.55,91.76 88.14,90.17 140.53,90.17 197.04,33.66 199.58,33.66 v199.9,33.97
!DATA2  (via drill 0.51)
  Top 0.305: v86.55,90.49 86.55,89.85 84.65,89.85 E1.42 | v196.41,30.48 210.38,16.51 U$2.AU1
  Bottom 0.305: v86.55,90.49 86.23,90.17 82.11,90.17 81.47,89.53 81.47,88.27 85.28,88.27 85.92,88.9 118.94,88.9 177.35,30.48 v196.41,30.48
!DATA3  (via drill 0.51)
  Top 0.305: v82.42,89.22 82.42,87.95 84.33,87.95 E1.39 | v160.53,54.61 196.09,19.05 207.2,19.05 U$2.AV1
  Bottom 0.305: v82.42,89.22 82.74,89.53 125.6,89.53 v160.53,54.61
!DATA4  (via drill 0.51)
  Top 0.305: v87.5,83.82 87.5,84.14 84.65,84.14 E1.33 | v93.85,77.47 150.05,21.27 U$2.BR1
  Bottom 0.305: v93.85,77.47 v87.5,83.82
!DATA5  (via drill 0.51)
  Top 0.305: v86.55,79.69 86.55,83.5 84.65,83.5 E1.32 | v110.68,55.24 146.88,19.05 U$2.BS1
  Bottom 0.305: v86.55,79.69 86.55,78.74 87.19,78.74 v110.68,55.24
!DATA6  (via drill 0.51)
  Top 0.305: v85.28,79.69 85.28,81.92 84.65,82.55 E1.31 | v110.68,53.98 140.53,24.13 U$2.BU1
  Bottom 0.305: v85.28,79.69 85.28,78.74 85.92,78.74 v110.68,53.98
!DATA7  (via drill 0.51)
  Top 0.305: v83.06,79.06 82.42,79.69 82.42,80.64 E1.29 | v110.68,51.44 137.35,24.77 U$2.BV1
  Bottom 0.305: v110.68,51.44 v83.06,79.06
!DATA8  (via drill 0.51)
  Top 0.305: v62.74,72.39 68.77,78.42 68.77,80.64 E1.8 | v49.72,59.37 16.7,26.35 U$2.DR1
  Bottom 0.305: v49.72,59.37 v62.74,72.39
!DATA9  (via drill 0.51)
  Top 0.305: v61.47,74.3 65.28,78.11 65.28,80.64 E1.3 | v49.72,62.55 22.1,34.92 22.1,32.38 13.52,23.81 U$2.DS1
  Bottom 0.305: v49.72,62.55 v61.47,74.3
!DATA10  (via drill 0.51)
  Top 0.305: v59.25,73.34 63.05,73.34 68.14,78.42 68.14,80.64 E1.7 | v17.65,35.88 7.18,25.4 U$2.DU1
  Bottom 0.305: v59.25,73.34 23.37,37.47 19.24,37.47 v17.65,35.88
!DATA11  (via drill 0.51)
  Top 0.305: v65.91,77.47 65.91,80.64 E1.4 | v18.29,37.78 4,23.5 U$2.DV1
  Bottom 0.305: v65.91,77.47 63.69,75.25 55.75,75.25 v18.29,37.78
!DONE_SKIP  (via drill 0.51)
  Top 0.305: v75.44,86.04 75.76,86.36 75.76,96.84 E1.62 | v110.68,49.53 124.65,35.56 U$2.CB1
  Bottom 0.305: v75.44,86.04 75.44,79.69 80.52,79.69 v110.68,49.53
!INT_RQST  (via drill 0.51)
  Top 0.305: v76.39,34.61 73.85,37.15 73.85,80.64 E1.16 | v80.84,30.16 89.73,21.27 U$2.CP1
  Bottom 0.305: v80.84,30.16 v76.39,34.61
!INTERNAL_IO  (via drill 0.51)
  Top 0.305: v77.03,74.3 77.03,80.64 E1.21 | v82.74,68.58 99.25,52.07 U$2.CL1
  Bottom 0.305: v82.74,68.58 v77.03,74.3
!IO_PAUSE  (via drill 0.51)
  Top 0.305: v80.52,78.42 80.52,80.64 E1.26 | v110.68,48.26 118.3,40.64 U$2.CD1
  Bottom 0.305: v110.68,48.26 v80.52,78.42
!MD03  (via drill 0.51)
  Top 0.305: v86.55,93.66 86.55,93.03 84.65,93.03 E1.47 | v160.53,77.15 223.07,14.61 U$2.AP1
  Bottom 0.305: v86.55,93.66 86.87,93.34 144.34,93.34 v160.53,77.15
!MD04  (via drill 0.51)
  Top 0.305: v86.55,87.31 84.65,87.31 E1.38 | v160.53,20.95 165.93,15.56 U$2.BK1
  Bottom 0.305: v86.55,87.31 93.22,80.64 100.84,80.64 v160.53,20.95
!MD05
  Top 0.305: U$2.BL1 162.75,13.97 159.57,17.14 159.57,78.42 85.28,78.42 84.33,79.38 84.33,80.96 83.38,81.92 83.38,83.5 81.79,85.09 81.79,86.68 84.33,86.68 E1.37
!MD06  (via drill 0.51)
  Top 0.305: v82.74,85.41 84.33,85.41 E1.35 | v51.62,99.38 51.94,99.69 51.94,118.43 51.62,118.75 51.62,126.05 E31.4 | U$2.BM1 158.94,8.57 158.94,15.88 152.91,21.91 151,21.91 v151,21.27
  Bottom 0.305: v51.62,99.38 55.43,99.38 67.82,87 81.15,87 v82.74,85.41 84.33,85.41 93.22,76.52 95.76,76.52 v151,21.27
!MD07  (via drill 0.51)
  Top 0.305: 88.45,84.77 84.65,84.77 E1.34 | 88.45,84.77 88.45,106.05 v83.06,111.44 | U$2.BP1 152.59,8.57 v152.59,20.95 | 88.45,84.77 v93.54,79.69
  Bottom 0.305: v83.06,111.44 68.45,126.05 49.09,126.05 E31.5 | v152.59,20.95 93.85,79.69 v93.54,79.69
!MD08  (via drill 0.51)
  Top 0.305: v70.04,87.95 70.04,85.72 71.31,84.45 71.31,80.96 E1.12 | 50.67,100.97 46.54,105.09 46.54,126.05 E31.6 | 50.67,100.97 v50.99,100.65 50.67,100.97 | U$2.DK1 33.21,8.57 33.21,37.78 50.67,55.24 50.67,100.97
  Bottom 0.305: v70.04,87.95 57.34,100.65 v50.99,100.65
!MD09  (via drill 0.51)
  Top 0.305: v70.68,76.52 70.68,80.64 E1.11 | v49.72,55.56 29.4,35.24 U$2.DL1
  Bottom 0.305: v49.72,55.56 v70.68,76.52
!MD10  (via drill 0.51)
  Top 0.305: v68.77,75.88 70.04,77.15 70.04,80.64 E1.10 | v49.72,56.83 26.23,33.34 U$2.DM1
  Bottom 0.305: v49.72,56.83 v68.77,75.88
!MD11  (via drill 0.51)
  Top 0.305: v67.5,75.88 69.41,77.79 69.41,80.64 E1.9 | v49.72,58.1 19.88,28.26 U$2.DP1
  Bottom 0.305: v49.72,58.1 v67.5,75.88
!RX_12_BIT  (via drill 0.51)
  Top 0.305: v60.52,91.76 62.42,91.76 E1.86 | v49.72,98.42 35.11,113.03 35.11,160.02 | 35.11,160.02 35.11,161.61 R7.1 | 35.11,160.02 R16.2 DRIVE.FF
  Bottom 0.305: v60.52,91.76 53.85,98.42 v49.72,98.42
!RX_DATA  (via drill 0.51)
  Top 0.305: v58.29,141.29 60.2,139.38 60.2,93.66 62.42,93.66 E1.83 | R17.2 DRIVE.BB
  Bottom 0.305: v58.29,141.29 34.48,165.1 34.16,165.1 | R17.2 34.16,165.1 | 34.16,165.1 R8.1
!RX_DONE
  Top 0.305: R13.2 32.89,167.32 36.39,163.83 36.39,148.91 43.69,148.91 45.28,150.5 45.28,154.31 46.54,154.31 60.83,140.02 60.83,96.84 62.42,95.25 E1.81 | R4.1 32.89,171.45 R13.2 | R13.2 DRIVE.X
!RX_ERROR
  Top 0.305: E1.74 68.14,97.16 68.14,170.81 44.96,193.99 35.11,193.99 35.11,188.91 R5.1 34.16,186.69 R14.2 DRIVE.J
!RX_INIT  (via drill 0.51)
  Top 0.305: v65.28,150.81 65.28,97.16 E1.78 | R9.1 DRIVE.N
  Bottom 0.305: v65.28,150.81 44.32,171.77 43.69,171.77 35.11,180.34 R9.1
!RX_OUT  (via drill 0.51)
  Top 0.305: v63.05,80.96 64.01,80.96 E1.1 | v49.72,94.3 32.89,111.12 R12.2 | R3.1 32.89,151.13 R12.2 | R12.2 DRIVE.RR
  Bottom 0.305: v49.72,94.3 v63.05,80.96
!RX_RUN
  Top 0.305: E1.72 69.41,97.16 69.41,170.18 44.96,194.63 34.16,194.63 R6.1 34.16,191.77 R15.2 DRIVE.D
!RX_SHIFT  (via drill 0.51)
  Top 0.305: v46.54,142.24 54.16,134.62 54.16,119.38 56.07,117.47 56.07,83.5 62.42,83.5 E1.99 | R10.2 DRIVE.LL
  Bottom 0.305: 33.84,154.94 v46.54,142.24 | R10.2 33.84,154.94 | R2.1 34.16,154.94 33.84,154.94
!RX_TR_REQ  (via drill 0.51)
  Top 0.305: v59.88,154.94 64.64,150.18 64.64,97.16 E1.79 | R1.1 34.16,176.53 R11.2 DRIVE.T
  Bottom 0.305: v59.88,154.94 37.02,177.8 R1.1
!SKIP  (via drill 0.51)
  Top 0.305: v72.58,32.07 72.58,80.64 E1.14 | v80.84,23.81 83.38,21.27 U$2.CS1
  Bottom 0.305: v80.84,23.81 v72.58,32.07
!TR_SKIP  (via drill 0.51)
  Top 0.305: v70.99,86.04 75.12,90.17 75.12,96.84 E1.63 | v63.37,78.74 54.8,70.17 U$2.DB1
  Bottom 0.305: v70.99,86.04 63.69,78.74 v63.37,78.74
GND  (via drill 0.51)
  Top 0.305: C1.2 76.39,100.01 76.39,97.16 E1.61 | C2.2 66.87,100.01 66.87,97.16 E1.76 66.55,96.84 66.55,93.66 63.37,90.49 | 63.37,90.49 65.28,88.58 65.28,84.77 62.74,84.77 E1.97 | 63.37,90.49 62.74,90.49 E1.88 | R15.1 R14.1 43.05,182.88 | R12.1 R10.1 R16.1 R17.1 R13.1 R11.1 43.05,182.88 | DRIVE.B DRIVE.A DRIVE.C DRIVE.E | DRIVE.E DRIVE.F | DRIVE.K DRIVE.H DRIVE.E | DRIVE.K DRIVE.L 43.05,182.88 | DRIVE.P DRIVE.M DRIVE.K | DRIVE.P DRIVE.R | DRIVE.U DRIVE.S DRIVE.P | DRIVE.U DRIVE.V | DRIVE.Y DRIVE.W DRIVE.U | DRIVE.Y DRIVE.Z | DRIVE.CC DRIVE.AA DRIVE.Y | DRIVE.CC DRIVE.DD | DRIVE.HH DRIVE.EE DRIVE.CC | DRIVE.HH DRIVE.JJ | DRIVE.MM DRIVE.KK DRIVE.HH | DRIVE.MM DRIVE.NN | DRIVE.MM DRIVE.PP DRIVE.SS DRIVE.TT DRIVE.VV DRIVE.UU 25.27,111.76 C3.2 19.24,94.93 19.24,34.61 | v184.97,15.24 175.13,25.08 C44.- | U$2.AT2 v213.55,15.24 | 19.24,34.61 10.35,25.72 U$2.DT1 | 19.24,34.61 C42.- 19.24,34.61 | 83.38,91.44 83.69,91.76 84.33,91.76 E1.45 | 83.38,91.44 81.15,89.22 81.15,85.09 81.79,84.45 81.79,80.96 E1.28 81.79,80.64 81.79,42.55 C43.- 88.77,31.11 79.88,31.11 | 83.38,91.44 83.38,88.58 84.33,88.58 E1.40 | 79.88,31.11 72.26,31.11 71.63,31.75 71.63,32.38 71.95,32.7 71.95,80.64 E1.13 | U$2.CT1 79.88,8.26 79.88,31.11 | U$2.BT1 143.06,8.57 v143.06,20
  Bottom 0.305: C1.2 75.12,99.38 73.53,99.38 | 73.53,99.38 68.14,99.38 C2.2 | 73.53,99.38 73.53,100.65 71.95,102.23 15.75,102.23 C3.2 | C44.- 177.67,33.02 197.36,33.02 | 213.55,33.02 223.39,33.02 C45.- | 213.55,33.02 197.36,33.02 | v184.97,15.24 U$2.BC2 | 213.55,33.02 v213.55,15.24 213.55,14.92 | 213.55,14.92 U$2.AT2 | U$2.AC2 254.82,14.92 213.55,14.92 | 51.62,33.66 U$2.DC2 | 51.62,33.66 22.1,33.66 C42.- | U$2.CC2 121.48,16.51 115.12,16.51 | 115.12,16.51 107.82,16.51 C43.- 53.53,35.56 51.62,33.66 | 115.12,16.51 118.3,19.68 142.75,19.68 v143.06,20 160.84,20 165.61,24.77 197.36,24.77 197.36,33.02
  pour GND$: 0,18.41 2.41,18.41 2.41,13.97 59.56,13.97 59.56,15.88 69.09,15.88 69.09,18.41 72.26,18.41 72.26,13.97 129.41,13.97 129.41,15.88 132.59,15.88 132.59,18.41 135.76,18.41 135.76,13.97 192.91,13.97 192.91,15.88 202.44,15.88 202.44,18.41 205.61,18.41 205.61,13.97 262.76,13.97 262.76,15.88 265.3,15.88 265.3,214.63 0,214.63
INITIALIZE  (via drill 0.51)
  Top 0.305: v74.48,32.7 73.22,33.97 73.22,80.64 E1.15 | v80.84,26.35 86.55,20.64 U$2.CR1
  Bottom 0.305: v80.84,26.35 v74.48,32.7
N$1  (via drill 0.51)
  Top 0.305: v60.52,87.95 62.42,87.95 E1.92 | v55.12,93.34 53.21,95.25 E31.14
  Bottom 0.305: v55.12,93.34 v60.52,87.95 | E31.11 46.54,120.33 52.26,120.33 E31.14
N$5  (via drill 0.51)
  Top 0.305: v59.25,103.82 59.25,90.49 61.15,88.58 62.42,88.58 E1.91
  Bottom 0.305: 59.25,117.79 59.25,120.33 56.71,120.33 E31.15 | 59.25,117.79 v59.25,103.82 | E31.12 49.72,117.79 59.25,117.79
N$6  (via drill 0.51)
  Top 0.305: v60.52,90.49 60.52,89.85 62.42,89.85 E1.89 | v57.66,93.34 57.66,118.75 E31.16
  Bottom 0.305: v57.66,93.34 v60.52,90.49 | E31.13 51.62,118.43 57.34,118.43 E31.16
N$7  (via drill 0.51)
  Top 0.305: v60.52,86.68 62.42,86.68 E1.94 | v55.12,92.08 52.58,94.61 52.58,118.43 52.26,118.75 52.26,126.05 E31.3
  Bottom 0.305: v55.12,92.08 v60.52,86.68
N$8  (via drill 0.51)
  Top 0.305: v64.33,86.04 62.74,86.04 E1.95 | v57.66,92.08 56.71,93.03 56.71,126.05 E31.2
  Bottom 0.305: v64.33,86.04 60.83,89.53 60.2,89.53 v57.66,92.08
N$9
  Top 0.305: E31.1 59.25,126.05 59.25,118.75 58.29,117.79 58.29,103.5 58.61,103.19 58.61,85.41 62.42,85.41 E1.96
N$13
  Top 0.305: PAD10.1 E13.1
N$14
  Top 0.305: PAD11.1 E13.2
N$15
  Top 0.305: PAD12.1 E13.3
N$16
  Top 0.305: PAD13.1 E13.4
N$17
  Top 0.305: PAD14.1 E13.5
N$18
  Top 0.305: PAD15.1 E13.6
N$19
  Top 0.305: PAD16.1 E13.7
N$20
  Top 0.305: PAD17.1 E13.8
N$23
  Top 0.305: PAD20.1 E13.16
N$24
  Top 0.305: PAD21.1 E13.15
N$25
  Top 0.305: PAD22.1 E13.14
N$26
  Top 0.305: PAD23.1 E13.13
N$27
  Top 0.305: PAD24.1 E13.12
N$28
  Top 0.305: PAD25.1 E13.11
N$29
  Top 0.305: PAD26.1 E13.10
N$30
  Top 0.305: PAD27.1 E13.9
PARITY
  Top 0.305: U$2.AB1 258,120.65 91,120.65 77.03,106.68 77.03,97.16 E1.60
TCK
  Top 0.305: E1.64 74.48,97.16 74.48,100.33 74.48,183.83 ISP.1
TDI  (via drill 0.51)
  Top 0.305: v70.04,89.22 67.5,86.68 67.5,80.96 E1.6 | v89.41,96.84 92.58,100.01 93.54,100.97 v93.54,119.7
  Bottom 0.305: v70.04,89.22 77.66,96.84 v89.41,96.84 | ISP.9 93.54,183.2 v93.54,119.7
TDO  (via drill 0.51)
  Top 0.305: v67.5,95.25 67.5,96.84 E1.75 | v89.41,98.11 89.41,114.62 v87.82,116.2
  Bottom 0.305: v67.5,95.25 70.36,98.11 v89.41,98.11 | ISP.3 81.15,122.56 v87.82,116.2
TMS  (via drill 0.51)
  Top 0.305: v74.48,87.95 74.48,80.96 E1.17
  Bottom 0.305: v74.48,87.95 82.42,95.89 91.95,95.89 92.58,96.52 92.58,114.3 92.58,179.07 ISP.5
TP3  (via drill 0.51)
  Top 0.305: v78.3,82.55 78.3,80.96 E1.23 | v85.92,77.47 100.84,62.55 v100.84,21.91
  Bottom 0.305: v78.3,82.55 80.84,80.01 83.38,80.01 v85.92,77.47 | v100.84,21.91 108.78,13.97 U$2.CH2
TP4  (via drill 0.51)
  Top 0.305: v81.15,34.61 81.15,71.44 77.66,74.93 77.66,80.64 E1.22
  Bottom 0.305: v81.15,34.61 100.84,14.92 104.65,14.92 105.6,13.97 U$2.CJ2
VCC  (via drill 0.51)
  Top 0.305: R3.2 R2.2 R7.2 R8.2 R4.2 R1.2 R9.2 R5.2 R6.2 | 86.23,88.9 85.92,89.22 84.65,89.22 E1.41 | 86.23,88.9 87.5,87.63 87.5,86.04 84.65,86.04 E1.36 | E1.20 76.39,80.96 76.39,90.81 81.79,96.2 81.79,96.84 E1.53 81.79,97.16 81.79,99.69 | 81.79,99.69 C1.1 | 86.23,88.9 87.5,90.17 87.5,93.98 81.79,99.69 | C44.+ 192.59,30.16 v192.59,23.81 | v64.33,94.93 64.33,93.03 62.74,93.03 E1.84 | 63.69,87.31 62.74,87.31 E1.93 | 63.69,87.31 63.69,88.9 63.37,89.22 62.74,89.22 E1.90 | 66.87,87.31 66.87,90.81 71.95,95.89 71.95,96.84 E1.68 71.95,97.16 71.95,100.01 C2.1 | 66.87,87.31 66.87,82.23 | 66.87,82.23 66.87,80.96 E1.5 | v64.33,87.31 63.69,87.31 | 66.87,87.31 v66.23,87.31 | C42.+ 54.16,46.67 54.16,73.34 63.05,82.23 66.87,82.23 | v117.35,17.46 111.63,23.18 C43.+
  Bottom 0.305: C44.+ 199.9,37.47 246.89,37.47 C45.+ 261.18,35.56 U$2.AA2 | 192.59,19.05 192.59,16.51 191.32,15.24 U$2.BA2 | 192.59,19.05 v192.59,23.81 | 64.33,101.28 64.33,98.74 | 64.33,98.74 v64.33,94.93 | 64.33,101.28 71.31,101.28 C2.1 | C3.1 20.19,101.6 64.01,101.6 64.33,101.28 | v66.23,87.31 v64.33,87.31 | C43.+ 109.73,37.47 44.96,37.47 C42.+ | 127.83,17.46 U$2.CA2 | v117.35,17.46 127.83,17.46 | 192.59,19.05 129.41,19.05 127.83,17.46 | C1.1 79.56,98.74 64.33,98.74
  pour VCC$: 0,18.41 2.41,18.41 2.41,13.97 59.56,13.97 59.56,15.88 69.09,15.88 69.09,18.41 72.26,18.41 72.26,13.97 129.41,13.97 129.41,15.88 132.59,15.88 132.59,18.41 135.76,18.41 135.76,13.97 192.91,13.97 192.91,15.88 202.44,15.88 202.44,18.41 205.61,18.41 205.61,13.97 262.76,13.97 262.76,15.88 265.3,15.88 265.3,214.63 0,214.63

### Text on the board
Bottom: RX8-E Omnibus Interface M8357 | VRS
tPlace: RX8-E Omnibus Interface M8357 | VRS